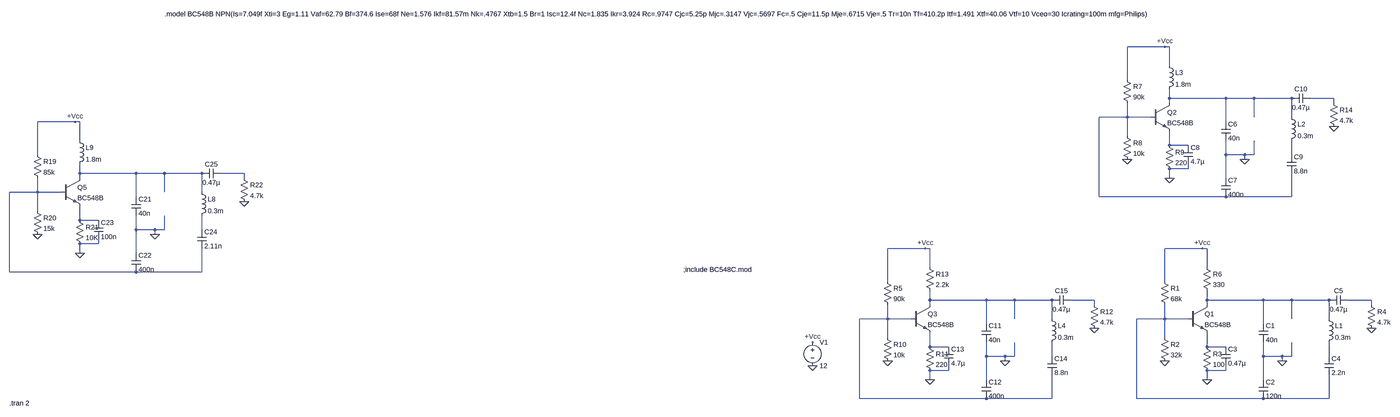
[diagram p0: schematic sapeeeee.asc, whole sheet]
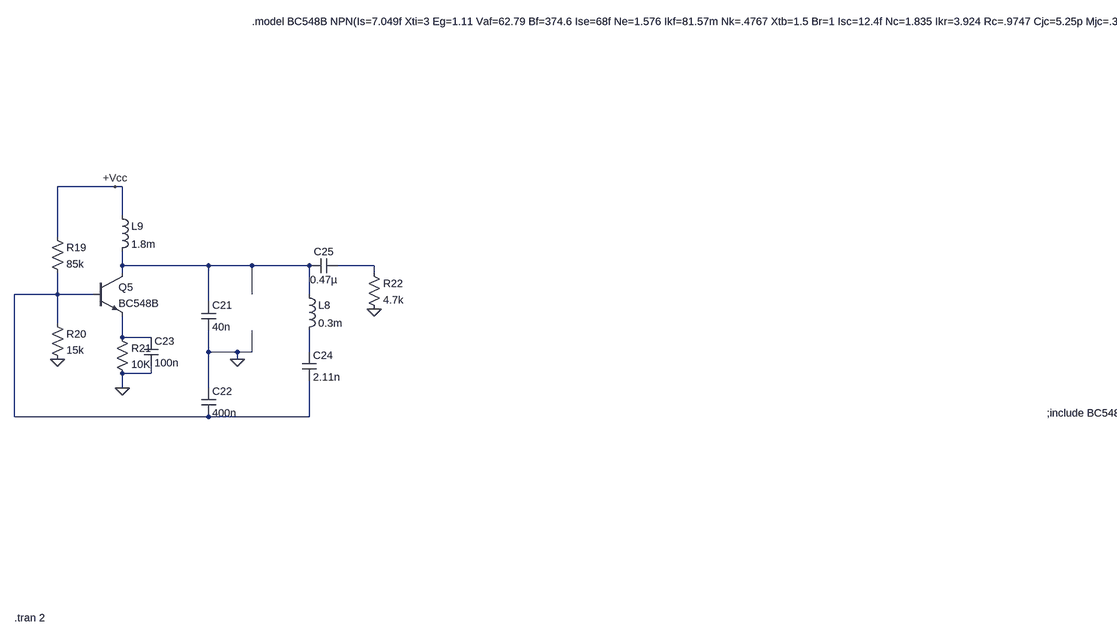
[diagram p1: schematic sapeeeee.asc, part, row 1 of 1, column 1 of 2]
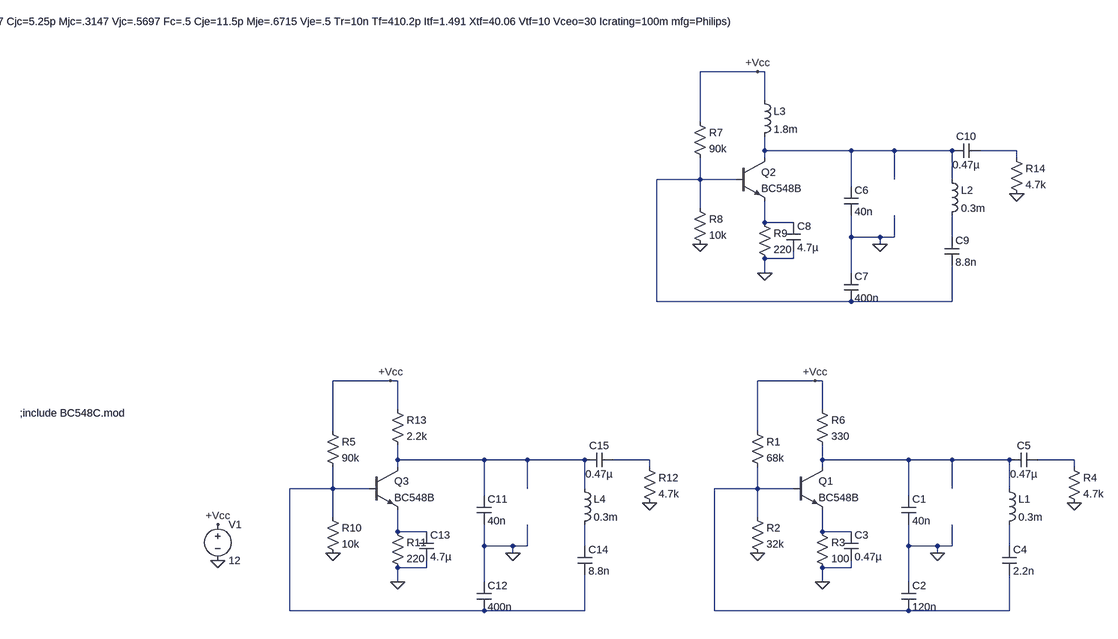
[diagram p2: schematic sapeeeee.asc, part, row 1 of 1, column 2 of 2]
sapeeeee.asc, the LTspice schematic file:
Version 4
SHEET 1 6252 1256
WIRE 2160 -816 2032 -816
WIRE 2176 -816 2160 -816
WIRE 2176 -752 2176 -816
WIRE 2032 -704 2032 -816
WIRE 2176 -640 2176 -672
WIRE 2368 -640 2176 -640
WIRE 2464 -640 2368 -640
WIRE 2592 -640 2464 -640
WIRE 2736 -640 2656 -640
WIRE 2176 -624 2176 -640
WIRE 2736 -624 2736 -640
WIRE 2032 -576 2032 -624
WIRE 2032 -576 1936 -576
WIRE 2112 -576 2032 -576
WIRE 2464 -576 2464 -640
WIRE 2592 -576 2592 -640
WIRE -1552 -560 -1680 -560
WIRE -1536 -560 -1552 -560
WIRE 2368 -560 2368 -640
WIRE 2032 -512 2032 -576
WIRE -1536 -496 -1536 -560
WIRE 2176 -480 2176 -528
WIRE 2240 -480 2176 -480
WIRE -1680 -448 -1680 -560
WIRE 2368 -448 2368 -496
WIRE 2432 -448 2368 -448
WIRE 2464 -448 2464 -496
WIRE 2464 -448 2432 -448
WIRE 2592 -448 2592 -496
WIRE 2432 -432 2432 -448
WIRE 2240 -400 2240 -416
WIRE 2240 -400 2176 -400
WIRE -1536 -384 -1536 -416
WIRE -1344 -384 -1536 -384
WIRE -1248 -384 -1344 -384
WIRE -1120 -384 -1248 -384
WIRE -976 -384 -1056 -384
WIRE -1536 -368 -1536 -384
WIRE -976 -368 -976 -384
WIRE 2176 -368 2176 -400
WIRE 2368 -368 2368 -448
WIRE -1680 -320 -1680 -368
WIRE -1680 -320 -1776 -320
WIRE -1600 -320 -1680 -320
WIRE -1248 -320 -1248 -384
WIRE -1120 -320 -1120 -384
WIRE -1344 -304 -1344 -384
WIRE 1936 -304 1936 -576
WIRE 2368 -304 1936 -304
WIRE 2592 -304 2592 -384
WIRE 2592 -304 2368 -304
WIRE -1680 -256 -1680 -320
WIRE -1536 -224 -1536 -272
WIRE -1472 -224 -1536 -224
WIRE -1344 -192 -1344 -240
WIRE -1280 -192 -1344 -192
WIRE -1248 -192 -1248 -240
WIRE -1248 -192 -1280 -192
WIRE -1120 -192 -1120 -240
WIRE -1280 -176 -1280 -192
WIRE -1472 -144 -1472 -160
WIRE -1472 -144 -1536 -144
WIRE 1344 -128 1216 -128
WIRE 1360 -128 1344 -128
WIRE 2288 -128 2160 -128
WIRE 2304 -128 2288 -128
WIRE -1536 -112 -1536 -144
WIRE -1344 -112 -1344 -192
WIRE 1360 -64 1360 -128
WIRE 2304 -64 2304 -128
WIRE -1776 -48 -1776 -320
WIRE -1344 -48 -1776 -48
WIRE -1120 -48 -1120 -128
WIRE -1120 -48 -1344 -48
WIRE 1216 -16 1216 -128
WIRE 2160 -16 2160 -128
WIRE 1360 48 1360 16
WIRE 1552 48 1360 48
WIRE 1648 48 1552 48
WIRE 1776 48 1648 48
WIRE 1920 48 1840 48
WIRE 2304 48 2304 16
WIRE 2496 48 2304 48
WIRE 2592 48 2496 48
WIRE 2720 48 2592 48
WIRE 2864 48 2784 48
WIRE 1360 64 1360 48
WIRE 1920 64 1920 48
WIRE 2304 64 2304 48
WIRE 2864 64 2864 48
WIRE 1216 112 1216 64
WIRE 1216 112 1120 112
WIRE 1296 112 1216 112
WIRE 1648 112 1648 48
WIRE 1776 112 1776 48
WIRE 2160 112 2160 64
WIRE 2160 112 2064 112
WIRE 2240 112 2160 112
WIRE 2592 112 2592 48
WIRE 2720 112 2720 48
WIRE 1552 128 1552 48
WIRE 2496 128 2496 48
WIRE 1216 176 1216 112
WIRE 2160 176 2160 112
WIRE 1360 208 1360 160
WIRE 1424 208 1360 208
WIRE 2304 208 2304 160
WIRE 2368 208 2304 208
WIRE 1552 240 1552 192
WIRE 1616 240 1552 240
WIRE 1648 240 1648 192
WIRE 1648 240 1616 240
WIRE 1776 240 1776 192
WIRE 2496 240 2496 192
WIRE 2560 240 2496 240
WIRE 2592 240 2592 192
WIRE 2592 240 2560 240
WIRE 2720 240 2720 192
WIRE 1616 256 1616 240
WIRE 2560 256 2560 240
WIRE 1424 288 1424 272
WIRE 1424 288 1360 288
WIRE 2368 288 2368 272
WIRE 2368 288 2304 288
WIRE 1360 320 1360 288
WIRE 1552 320 1552 240
WIRE 2304 320 2304 288
WIRE 2496 320 2496 240
WIRE 1120 384 1120 112
WIRE 1552 384 1120 384
WIRE 1776 384 1776 304
WIRE 1776 384 1552 384
WIRE 2064 384 2064 112
WIRE 2496 384 2064 384
WIRE 2720 384 2720 304
WIRE 2720 384 2496 384
FLAG 960 192 +Vcc
FLAG 960 272 0
FLAG -1280 -176 0
FLAG -1536 -112 0
FLAG -1680 -176 0
FLAG -976 -288 0
FLAG -1552 -560 +Vcc
FLAG 1616 256 0
FLAG 1360 320 0
FLAG 1216 256 0
FLAG 1920 144 0
FLAG 1344 -128 +Vcc
FLAG 2560 256 0
FLAG 2304 320 0
FLAG 2160 256 0
FLAG 2864 144 0
FLAG 2288 -128 +Vcc
FLAG 2432 -432 0
FLAG 2176 -368 0
FLAG 2032 -432 0
FLAG 2736 -544 0
FLAG 2160 -816 +Vcc
DATAFLAG 1408 48 ""
DATAFLAG 2224 -640 ""
SYMBOL voltage 960 176 R0
WINDOW 123 0 0 Left 2
WINDOW 39 0 0 Left 2
SYMATTR InstName V1
SYMATTR Value 12
SYMBOL cap -1360 -304 R0
SYMATTR InstName C21
SYMATTR Value 40n
SYMBOL res -1696 -464 R0
SYMATTR InstName R19
SYMATTR Value 85k
SYMBOL res -1696 -272 R0
SYMATTR InstName R20
SYMATTR Value 15k
SYMBOL cap -1360 -112 R0
SYMATTR InstName C22
SYMATTR Value 400n
SYMBOL res -1552 -240 R0
SYMATTR InstName R21
SYMATTR Value 10K
SYMBOL cap -1488 -224 R0
SYMATTR InstName C23
SYMATTR Value 100n
SYMBOL cap -1136 -192 R0
SYMATTR InstName C24
SYMATTR Value 2.11n
SYMBOL ind -1136 -336 R0
SYMATTR InstName L8
SYMATTR Value 0.3m
SYMATTR SpiceLine Rser=5.5
SYMBOL cap -1056 -400 R90
WINDOW 0 0 32 VBottom 2
WINDOW 3 32 32 VTop 2
SYMATTR InstName C25
SYMATTR Value 0.47µ
SYMBOL res -992 -384 R0
SYMATTR InstName R22
SYMATTR Value 4.7k
SYMBOL ind -1552 -512 R0
SYMATTR InstName L9
SYMATTR Value 1.8m
SYMBOL npn -1600 -368 R0
SYMATTR InstName Q5
SYMATTR Value BC548B
SYMBOL cap 1536 128 R0
SYMATTR InstName C11
SYMATTR Value 40n
SYMBOL res 1200 -32 R0
SYMATTR InstName R5
SYMATTR Value 90k
SYMBOL res 1200 160 R0
SYMATTR InstName R10
SYMATTR Value 10k
SYMBOL cap 1536 320 R0
SYMATTR InstName C12
SYMATTR Value 400n
SYMBOL res 1344 192 R0
SYMATTR InstName R11
SYMATTR Value 220
SYMBOL cap 1408 208 R0
SYMATTR InstName C13
SYMATTR Value 4.7µ
SYMBOL cap 1760 240 R0
SYMATTR InstName C14
SYMATTR Value 8.8n
SYMBOL ind 1760 96 R0
SYMATTR InstName L4
SYMATTR Value 0.3m
SYMATTR SpiceLine Rser=5.5
SYMBOL cap 1840 32 R90
WINDOW 0 0 32 VBottom 2
WINDOW 3 32 32 VTop 2
SYMATTR InstName C15
SYMATTR Value 0.47µ
SYMBOL res 1904 48 R0
SYMATTR InstName R12
SYMATTR Value 4.7k
SYMBOL npn 1296 64 R0
SYMATTR InstName Q3
SYMATTR Value BC548B
SYMBOL res 1344 -80 R0
SYMATTR InstName R13
SYMATTR Value 2.2k
SYMBOL cap 2480 128 R0
SYMATTR InstName C1
SYMATTR Value 40n
SYMBOL res 2144 -32 R0
SYMATTR InstName R1
SYMATTR Value 68k
SYMBOL res 2144 160 R0
SYMATTR InstName R2
SYMATTR Value 32k
SYMBOL cap 2480 320 R0
SYMATTR InstName C2
SYMATTR Value 120n
SYMBOL res 2288 192 R0
SYMATTR InstName R3
SYMATTR Value 100
SYMBOL cap 2352 208 R0
SYMATTR InstName C3
SYMATTR Value 0.47µ
SYMBOL cap 2704 240 R0
SYMATTR InstName C4
SYMATTR Value 2.2n
SYMBOL ind 2704 96 R0
SYMATTR InstName L1
SYMATTR Value 0.3m
SYMATTR SpiceLine Rser=5.5
SYMBOL cap 2784 32 R90
WINDOW 0 0 32 VBottom 2
WINDOW 3 32 32 VTop 2
SYMATTR InstName C5
SYMATTR Value 0.47µ
SYMBOL res 2848 48 R0
SYMATTR InstName R4
SYMATTR Value 4.7k
SYMBOL npn 2240 64 R0
SYMATTR InstName Q1
SYMATTR Value BC548B
SYMBOL res 2288 -80 R0
SYMATTR InstName R6
SYMATTR Value 330
SYMBOL cap 2352 -560 R0
SYMATTR InstName C6
SYMATTR Value 40n
SYMBOL res 2016 -720 R0
SYMATTR InstName R7
SYMATTR Value 90k
SYMBOL res 2016 -528 R0
SYMATTR InstName R8
SYMATTR Value 10k
SYMBOL cap 2352 -368 R0
SYMATTR InstName C7
SYMATTR Value 400n
SYMBOL res 2160 -496 R0
SYMATTR InstName R9
SYMATTR Value 220
SYMBOL cap 2224 -480 R0
SYMATTR InstName C8
SYMATTR Value 4.7µ
SYMBOL cap 2576 -448 R0
SYMATTR InstName C9
SYMATTR Value 8.8n
SYMBOL ind 2576 -592 R0
SYMATTR InstName L2
SYMATTR Value 0.3m
SYMATTR SpiceLine Rser=5.5
SYMBOL cap 2656 -656 R90
WINDOW 0 0 32 VBottom 2
WINDOW 3 32 32 VTop 2
SYMATTR InstName C10
SYMATTR Value 0.47µ
SYMBOL res 2720 -640 R0
SYMATTR InstName R14
SYMATTR Value 4.7k
SYMBOL npn 2112 -624 R0
SYMATTR InstName Q2
SYMATTR Value BC548B
SYMBOL ind 2160 -768 R0
SYMATTR InstName L3
SYMATTR Value 1.8m
TEXT 520 -56 Left 2 !;include BC548C.mod
TEXT -1248 -928 Left 2 !.model BC548B NPN(Is=7.049f Xti=3 Eg=1.11 Vaf=62.79 Bf=374.6 Ise=68f Ne=1.576 Ikf=81.57m Nk=.4767 Xtb=1.5 Br=1 Isc=12.4f Nc=1.835 Ikr=3.924 Rc=.9747 Cjc=5.25p Mjc=.3147 Vjc=.5697 Fc=.5 Cje=11.5p Mje=.6715 Vje=.5 Tr=10n Tf=410.2p Itf=1.491 Xtf=40.06 Vtf=10 Vceo=30 Icrating=100m mfg=Philips)
TEXT -1776 400 Left 2 !.tran 2

The netlist it stands for:
* sapeeeee.asc
V1 +Vcc 0 12
C21 N006 0 40n
R19 +Vcc N008 85k
R20 N008 0 15k
C22 0 N008 400n
R21 N009 0 10K
C23 N009 0 100n
C24 N010 N008 2.11n
L8 N006 N010 0.3m Rser=5.5
C25 N007 N006 0.47µ
R22 N007 0 4.7k
L9 +Vcc N006 1.8m
Q5 N006 N008 N009 0 BC548B
C11 N011 0 40n
R5 +Vcc N015 90k
R10 N015 0 10k
C12 0 N015 400n
R11 N017 0 220
C13 N017 0 4.7µ
C14 N019 N015 8.8n
L4 N011 N019 0.3m Rser=5.5
C15 N012 N011 0.47µ
R12 N012 0 4.7k
Q3 N011 N015 N017 0 BC548B
R13 +Vcc N011 2.2k
C1 N013 0 40n
R1 +Vcc N016 68k
R2 N016 0 32k
C2 0 N016 120n
R3 N018 0 100
C3 N018 0 0.47µ
C4 N020 N016 2.2n
L1 N013 N020 0.3m Rser=5.5
C5 N014 N013 0.47µ
R4 N014 0 4.7k
Q1 N013 N016 N018 0 BC548B
R6 +Vcc N013 330
C6 N001 0 40n
R7 +Vcc N003 90k
R8 N003 0 10k
C7 0 N003 400n
R9 N004 0 220
C8 N004 0 4.7µ
C9 N005 N003 8.8n
L2 N001 N005 0.3m Rser=5.5
C10 N002 N001 0.47µ
R14 N002 0 4.7k
Q2 N001 N003 N004 0 BC548B
L3 +Vcc N001 1.8m
.model NPN NPN
.model PNP PNP
.lib standard.bjt
;include BC548C.mod
.model BC548B NPN(Is=7.049f Xti=3 Eg=1.11 Vaf=62.79 Bf=374.6 Ise=68f Ne=1.576 Ikf=81.57m Nk=.4767 Xtb=1.5 Br=1 Isc=12.4f Nc=1.835 Ikr=3.924 Rc=.9747 Cjc=5.25p Mjc=.3147 Vjc=.5697 Fc=.5 Cje=11.5p Mje=.6715 Vje=.5 Tr=10n Tf=410.2p Itf=1.491 Xtf=40.06 Vtf=10 Vceo=30 Icrating=100m mfg=Philips)
.tran 2
.backanno
.end